# Altium project LaunchPadComputer.PrjPcb
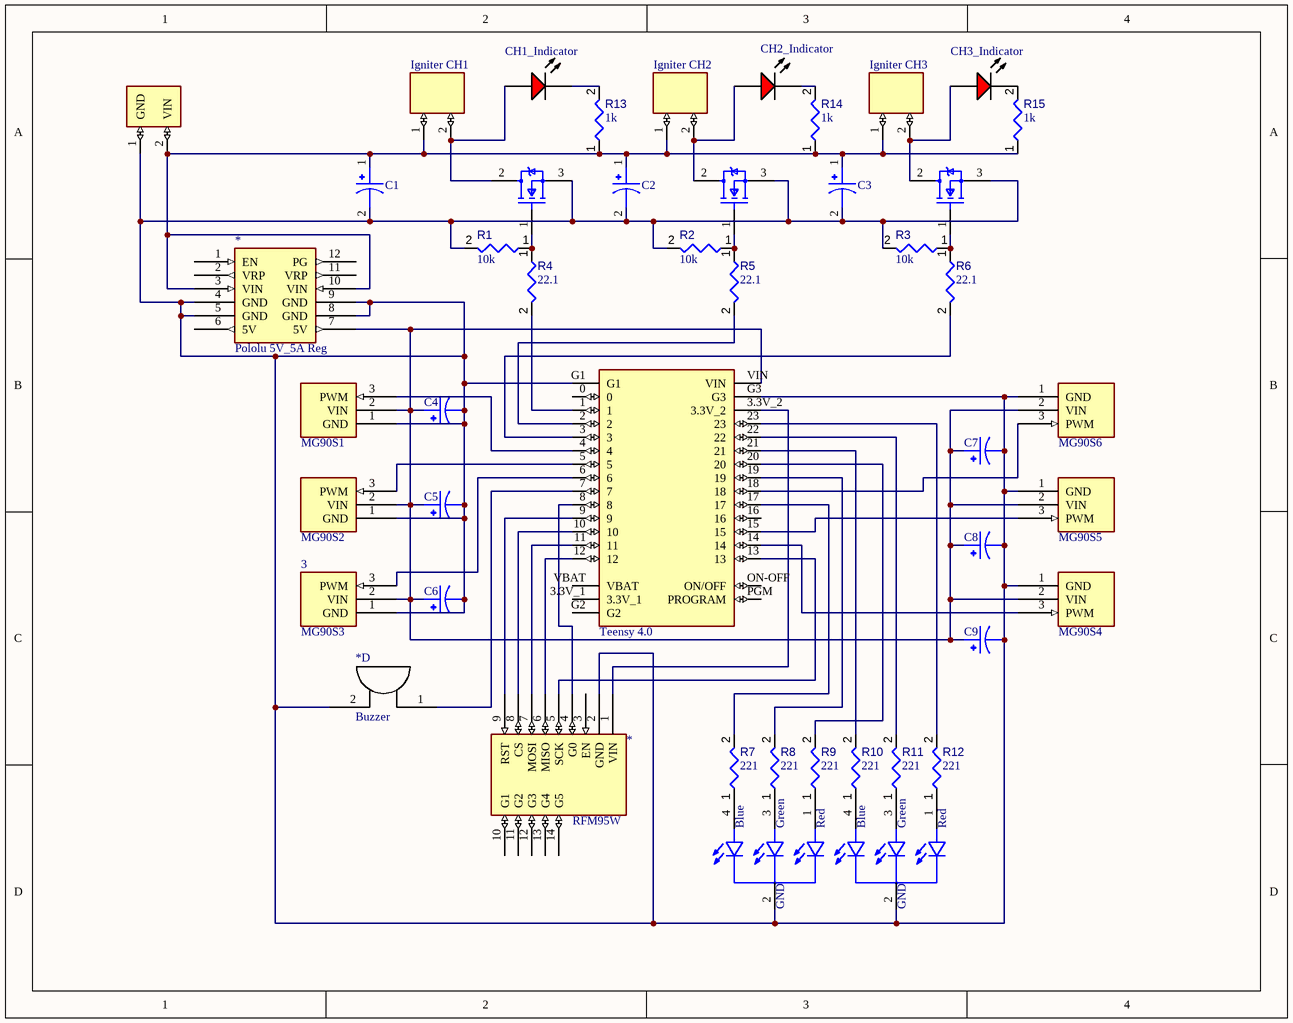
[diagram p0: LaunchPadComputerSchematic.SchDoc]
1 sheet, 46 parts. Net scope: global (net labels, ports and power ports of the same name join across sheets).
Board file: LaunchPadComputer.PcbDoc

## Sheet LaunchPadComputerSchematic.SchDoc
size A; SheetNumber: 1; SheetTotal: 1

### Parts
(Parts that share a designator on the sheet are numbered #1, #2 ... from top to bottom, then left to right.)
1  MG90S1  [MG90S]
2  MG90S2  [MG90S]
3  MG90S3  [MG90S]
4  MG90S4  [MG90S]
5  MG90S5  [MG90S]
6  MG90S6  [MG90S]
*#1  Pololu 5V_5A Reg  [Pololu 5V_5A Reg]
*#2  Buzzer  [Buzzer]  (part D of 4)
*#3  RFM95W  [RFM95W]
C1  478CKS010M  [Capacitor]  (value not drawn)
C2  478CKS010M  [Capacitor]  (value not drawn)
C3  478CKS010M  [Capacitor]  (value not drawn)
C4  478CKS010M  [Capacitor]  (value not drawn)
C5  478CKS010M  [Capacitor]  (value not drawn)
C6  478CKS010M  [Capacitor]  (value not drawn)
C7  478CKS010M  [Capacitor]  (value not drawn)
C8  478CKS010M  [Capacitor]  (value not drawn)
C9  478CKS010M  [Capacitor]  (value not drawn)
CH1_Indicator  LTL-1CHE  [INDPR60-254-520X380X650]  (value not drawn)
CH2_Indicator  LTL-1CHE  [INDPR60-254-520X380X650]  (value not drawn)
CH3_Indicator  LTL-1CHE  [INDPR60-254-520X380X650]  (value not drawn)
D?#1  RGB LED  [RGB LED]  (value not drawn)
D?#2  RGB LED  [RGB LED]  (value not drawn)
Igniter_CH1  Igniter CH1  [Term Blk 2Pos 5mm]
Igniter_CH2  Igniter CH2  [Term Blk 2Pos 5mm]
Igniter_CH3  Igniter CH3  [Term Blk 2Pos 5mm]
J?  Term Blk 2Pos 5mm  [Term Blk 2Pos 5mm]  (value not drawn)
MOSFET1  IRLZ44NPbF  [FP-PG-TO220-3-MFG]  (value not drawn)
MOSFET2  IRLZ44NPbF  [FP-PG-TO220-3-MFG]  (value not drawn)
MOSFET3  IRLZ44NPbF  [FP-PG-TO220-3-MFG]  (value not drawn)
R1  value 10k  [RESA60-630X240]  (hidden comment: MFR-25FBF52-10K)
R2  value 10k  [RESA60-630X240]  (hidden comment: MFR-25FBF52-10K)
R3  value 10k  [RESA60-630X240]  (hidden comment: MFR-25FBF52-10K)
R4  value 22.1  [RESA60-630X240]  (hidden comment: MFR-25FBF52-22R1)
R5  value 22.1  [RESA60-630X240]  (hidden comment: MFR-25FBF52-22R1)
R6  value 22.1  [RESA60-630X240]  (hidden comment: MFR-25FBF52-22R1)
R7  value 221  [RESA60-630X240]  (hidden comment: MFR-25FBF52-221R)
R8  value 221  [RESA60-630X240]  (hidden comment: MFR-25FBF52-221R)
R9  value 221  [RESA60-630X240]  (hidden comment: MFR-25FBF52-221R)
R10  value 221  [RESA60-630X240]  (hidden comment: MFR-25FBF52-221R)
R11  value 221  [RESA60-630X240]  (hidden comment: MFR-25FBF52-221R)
R12  value 221  [RESA60-630X240]  (hidden comment: MFR-25FBF52-221R)
R13  value 1k  [RESA60-630X240]  (hidden comment: MFR-25FBF52-1K)
R14  value 1k  [RESA60-630X240]  (hidden comment: MFR-25FBF52-1K)
R15  value 1k  [RESA60-630X240]  (hidden comment: MFR-25FBF52-1K)
U?  Teensy 4.0  [Teensy 4.0]

### Nets
Net1_1: 1.1(GND) 2.1(GND) 3.1(GND) 4.1(GND) 5.1(GND) 6.1(GND) *#1.4(GND) *#1.5(GND) *#1.8(GND) *#1.9(GND) *#2.2(GND) *#3.2(GND) C1.2 C2.2 C3.2 C4.2 C5.2 C6.2 C7.2 C8.2 C9.2 D?#1.2(K) D?#2.2(K) J?.1(GND) MOSFET1.3(S) MOSFET2.3(S) MOSFET3.3(S) R1.2 R2.2 R3.2 U?.G1 U?.G3
Net1_2: 1.2(VIN) 2.2(VIN) 3.2(VIN) 4.2(VIN) 5.2(VIN) 6.2(VIN) *#1.7(5V) C4.1 C5.1 C6.1 C7.1 C8.1 C9.1 U?.VIN
Net1_3: 1.3(PWM) U?.4
Net2_3: 2.3(PWM) U?.5
Net3_3: 3.3(PWM) U?.6
Net4_3: 4.3(PWM) U?.14
Net5_3: 5.3(PWM) U?.15
Net6_3: 6.3(PWM) U?.18
Net*#1_3: *#1.3(VIN) *#1.10(VIN) C1.1 C2.1 C3.1 Igniter_CH1.1(GND) Igniter_CH2.1(GND) Igniter_CH3.1(GND) J?.2(VIN) R13.1 R14.1 R15.1
Net*#3_1: *#3.1(VIN) U?.3.3V_2
Net*#3_4: *#3.4(G0) U?.8
Net*#3_5: *#3.5(SCK) U?.13
Net*#3_6: *#3.6(MISO) U?.12
Net*#3_7: *#3.7(MOSI) U?.11
Net*#3_8: *#3.8(CS) U?.10
Net*#3_9: *#3.9(RST) U?.9
NetCH1_Indicator_1: CH1_Indicator.1(A) Igniter_CH1.2(VIN) MOSFET1.2(D)
NetCH1_Indicator_2: CH1_Indicator.2(K) R13.2
NetCH2_Indicator_1: CH2_Indicator.1(A) Igniter_CH2.2(VIN) MOSFET2.2(D)
NetCH2_Indicator_2: CH2_Indicator.2(K) R14.2
NetCH3_Indicator_1: CH3_Indicator.1(A) Igniter_CH3.2(VIN) MOSFET3.2(D)
NetCH3_Indicator_2: CH3_Indicator.2(K) R15.2
NetD?#1_1: D?#1.1(A_RED) R9.1
NetD?#1_3: D?#1.3(A_BLUE) R8.1
NetD?#1_4: D?#1.4(A_GREEN) R7.1
NetD?#2_1: D?#2.1(A_RED) R12.1
NetD?#2_3: D?#2.3(A_BLUE) R11.1
NetD?#2_4: D?#2.4(A_GREEN) R10.1
NetMOSFET1_1: MOSFET1.1(G) R1.1 R4.1
NetMOSFET2_1: MOSFET2.1(G) R2.1 R5.1
NetMOSFET3_1: MOSFET3.1(G) R3.1 R6.1
NetR4_2: R4.2 U?.1
NetR5_2: R5.2 U?.2
NetR6_2: R6.2 U?.3
NetR7_2: R7.2 U?.17
NetR8_2: R8.2 U?.19
NetR9_2: R9.2 U?.20
NetR10_2: R10.2 U?.21
NetR11_2: R11.2 U?.22
NetR12_2: R12.2 U?.23

Not connected (* = marked no-connect by the designer): *#1 1(EN) 2(VRP) 6(5V) 11(VRP) 12(PG); *#2 1(VIN); *#3 3(EN) 10(G1) 11(G2) 12(G3) 13(G4) 14(G5); U? 0 3.3V_1 7 16 G2 ON-OFF(ON/OFF) PGM(PROGRAM) VBAT

### Notes on the sheet
- (in symbol RGB LED) Blue; Green; Red; GND

### Library data of the parts
1-6 = CMP-009-000003-1: Design Item ID: MG90S; Source: MG90S.SchLib
*#1 = CMP-061-000000-1: Design Item ID: Pololu 5V_5A Reg; Source: Pololu 5V_5A Reg.SchLib
*#3 = CMP-052-000000-1: Design Item ID: RFM95W; Source: RFM95W.SchLib
C1-C9 = 478CKS010M: 4700 ÂµF 10 V Aluminum Electrolytic Capacitors Radial, Can 98.8mOhm @ 120Hz 2000 Hrs @ 85Â°C; MF: Illinois Capacitor; SnapEDA_Link: https://www.snapeda.com/parts/478CKS010M/Illinois+Capacitor/view-part/?ref=snap; Package: Radial Illinois Capacitor; Value: *; MP: 478CKS010M; Check_prices: https://www.snapeda.com/parts/478CKS010M/Illinois+Capacitor/view-part/?ref=eda
CH1_Indicator CH2_Indicator CH3_Indicator = CMP-007-00018-2: LED Uni-Color Red, 100 mW, 30 mA, -55 to 100 degC, 2-Pin THD, RoHS, Bulk; Manufacturer: Lite-On; Forward Current: 20mA; Nominal Vf: 2V; Viewing Angle: 60degrees; Luminous Intensity: 12.6mcd; Lens Style: Dome; Pins: 2; RoHS Compliant: True; Package Reference: LTL-1CHE; Package Quantity: 1000; Mounting Technology: TH; Min Operating Temperature: -55°C; Colour: Red; Case/Package: Radial; Manufacturer URL: http://www.us.liteon.com/; Datasheet URL: https://datasheet.ciiva.com/15117/getdatasheetpartid-187746-15117985.pdf; Forward Voltage: 2V; Max Operating Temperature: 100°C; Illumination Colour: Red; Package Description: 2-Pin Through Hole Device, Dia 3.8 mm, Pitch 2.54 mm; Packaging: Bulk; Datasheet Version: Dec-03
D?#1 D?#2 = RGB LED: Red, Green, Blue (RGB) 630nm Red, 525nm Green, 465nm Blue LED Indication - Discrete 1.9V Red, 3.3V Green, 3.3V Blue Radial - 4 Leads; MP: WP154A4SUREQBFZGC; MF: Kingbright; Check_prices: https://www.snapeda.com/parts/WP154A4SUREQBFZGC/Kingbright/view-part/?ref=eda; Value: *; Availability: In Stock; Price: None; Package: Radial-4 Kingbright; SnapEDA_Link: https://www.snapeda.com/parts/WP154A4SUREQBFZGC/Kingbright/view-part/?ref=snap; Purchase-URL: https://pricing.snapeda.com/search/part/WP154A4SUREQBFZGC/?ref=eda
Igniter_CH1-Igniter_CH3 J? = Term Blk 2Pos 5mm: Terminal block, EURO BLOCK, slotted screw, 5.00mm pitch, blue, 2 position | Adam Tech EBBA-02-C-SS-BU; SnapEDA_Link: https://www.snapeda.com/parts/EBBA-02-C-SS-BU/Adam+Tech/view-part/?ref=snap; Package: None; Value: *; MF: Adam Tech; MP: EBBA-02-C-SS-BU; Check_prices: https://www.snapeda.com/parts/EBBA-02-C-SS-BU/Adam+Tech/view-part/?ref=eda
MOSFET1-MOSFET3 = CMP-32901-000488-1: MOSFET N-CH 55V 47A TO220AB; Turn-On Delay Time: 11ns; Gate to Source Voltage (Vgs): 16V; Element Configuration: Single; Rds On Max: 22mR; Turn-Off Delay Time: 26ns; Max Power Dissipation: 110W; Threshold Voltage: 2V; Drain to Source Resistance: 35mR; Input Capacitance: 1.7nF; Continuous Drain Current (ID): 47A; Case/Package: TO-220; Lead Free: Lead Free; Halogen Free: Halogen Free; Packaging: Rail/Tube; Length: 0.414inch; Min Operating Temperature: -55°C; REACH SVHC: No SVHC; Number of Pins: 3; Width: 0.185inch; Drain to Source Voltage (Vdss): 55V; Power Dissipation: 110W; RoHS Compliant: Yes; Max Operating Temperature: 175°C; Height: 0.6inch; Max Dual Supply Voltage: 55V; Drain to Source Breakdown Voltage: 55V; Mount: Through Hole
R1-R3 = CMP-009-00047-4: Axial Resistor, 10 KOhm, +/- 1%, 0.25 W, -55 to 155 degC, 2-Pin THD, RoHS, Bulk; Manufacturer: Yageo; Power: 250mW; Voltage Rating: 250V; Manufacturer URL: http://www.yageo.com/; Datasheet URL: http://www.yageo.com/documents/recent/Yageo%20LR_MFR_2013.pdf; Package Reference: MFR-25; Min Operating Temperature: -55°C; Mounting Technology: TH; Package Quantity: 200; Case/Package: Axial; Tolerance: 1%; RoHS Compliant: True; Datasheet Version: Apr-13; Packaging: Bulk; Max Operating Temperature: 155°C; Package Description: 2-Pin Axial Lead, Dia 2.4 mm, Body Length 6.3 mm
R4-R6 = CMP-009-00053-4: Axial Resistor, 22.1 Ohm, +/- 1%, 250 mW, -55 to 155 degC, 2-Pin THD, RoHS, Bulk; Manufacturer: Yageo; Power: 250mW; Voltage Rating: 250V; Packaging: Bulk; Package Reference: MFR-25; Min Operating Temperature: -55°C; Mounting Technology: TH; Case/Package: Axial; Manufacturer URL: http://www.yageo.com/; Datasheet Version: Apr-13; Tolerance: 1%; Datasheet URL: http://www.yageo.com/documents/recent/Yageo%20LR_MFR_2013.pdf; RoHS Compliant: True; Package Description: 2-Pin Axial Lead, Dia 2.4 mm, Body Length 6.3 mm; Package Quantity: 200; Max Operating Temperature: 155°C
R7-R12 = CMP-009-00051-4: Axial Resistor, 221 Ohm, +/- 1%, 250 mW, -55 to 155 degC, 2-Pin THD, RoHS, Bulk; Manufacturer: Yageo; Power: 250mW; Voltage Rating: 250V; Package Quantity: 200; Manufacturer URL: http://www.yageo.com/; Case/Package: Axial; Package Reference: MFR-25; RoHS Compliant: True; Mounting Technology: TH; Datasheet URL: http://www.yageo.com/documents/recent/Yageo%20LR_MFR_2013.pdf; Packaging: Bulk; Package Description: 2-Pin Axial Lead, Dia 2.4 mm, Body Length 6.3 mm; Max Operating Temperature: 155°C; Tolerance: 1%; Datasheet Version: Apr-13; Min Operating Temperature: -55°C
R13-R15 = CMP-009-00048-4: Axial Resistor, 1 KOhm, +/- 1%, 250 mW, -55 to 155 degC, 2-Pin THD, RoHS, Bulk; Manufacturer: Yageo; Voltage Rating: 250V; Power: 250mW; Min Operating Temperature: -55°C; Max Operating Temperature: 155°C; Tolerance: 1%; Package Reference: MFR-25; Composition: CarbonFilm; Mounting Technology: TH; Packaging: Bulk; Case/Package: Axial; Datasheet URL: http://www.yageo.com/documents/recent/Yageo%20LR_MFR_2013.pdf; Package Quantity: 200; Manufacturer URL: http://www.yageo.com/; Package Description: 2-Pin Axial Lead, Dia 2.4 mm, Body Length 6.3 mm; Datasheet Version: Apr-13; RoHS Compliant: True
U? = CMP-040-000002-1: RT1062 Teensy 4.0 series ARMÂ® CortexÂ®-M7 MPU Embedded Evaluation Board; MF: SparkFun Electronics; MP: DEV-15583; Package: None; Value: *; Design Item ID: Teensy 4.0; Check_prices: https://www.snapeda.com/parts/DEV-15583/SparkFun/view-part/?ref=eda; Source: Teensy 4.0.SchLib; SnapEDA_Link: https://www.snapeda.com/parts/DEV-15583/SparkFun/view-part/?ref=snap